# Altium project FitC_Project.PrjPcb (part 1 of 2)
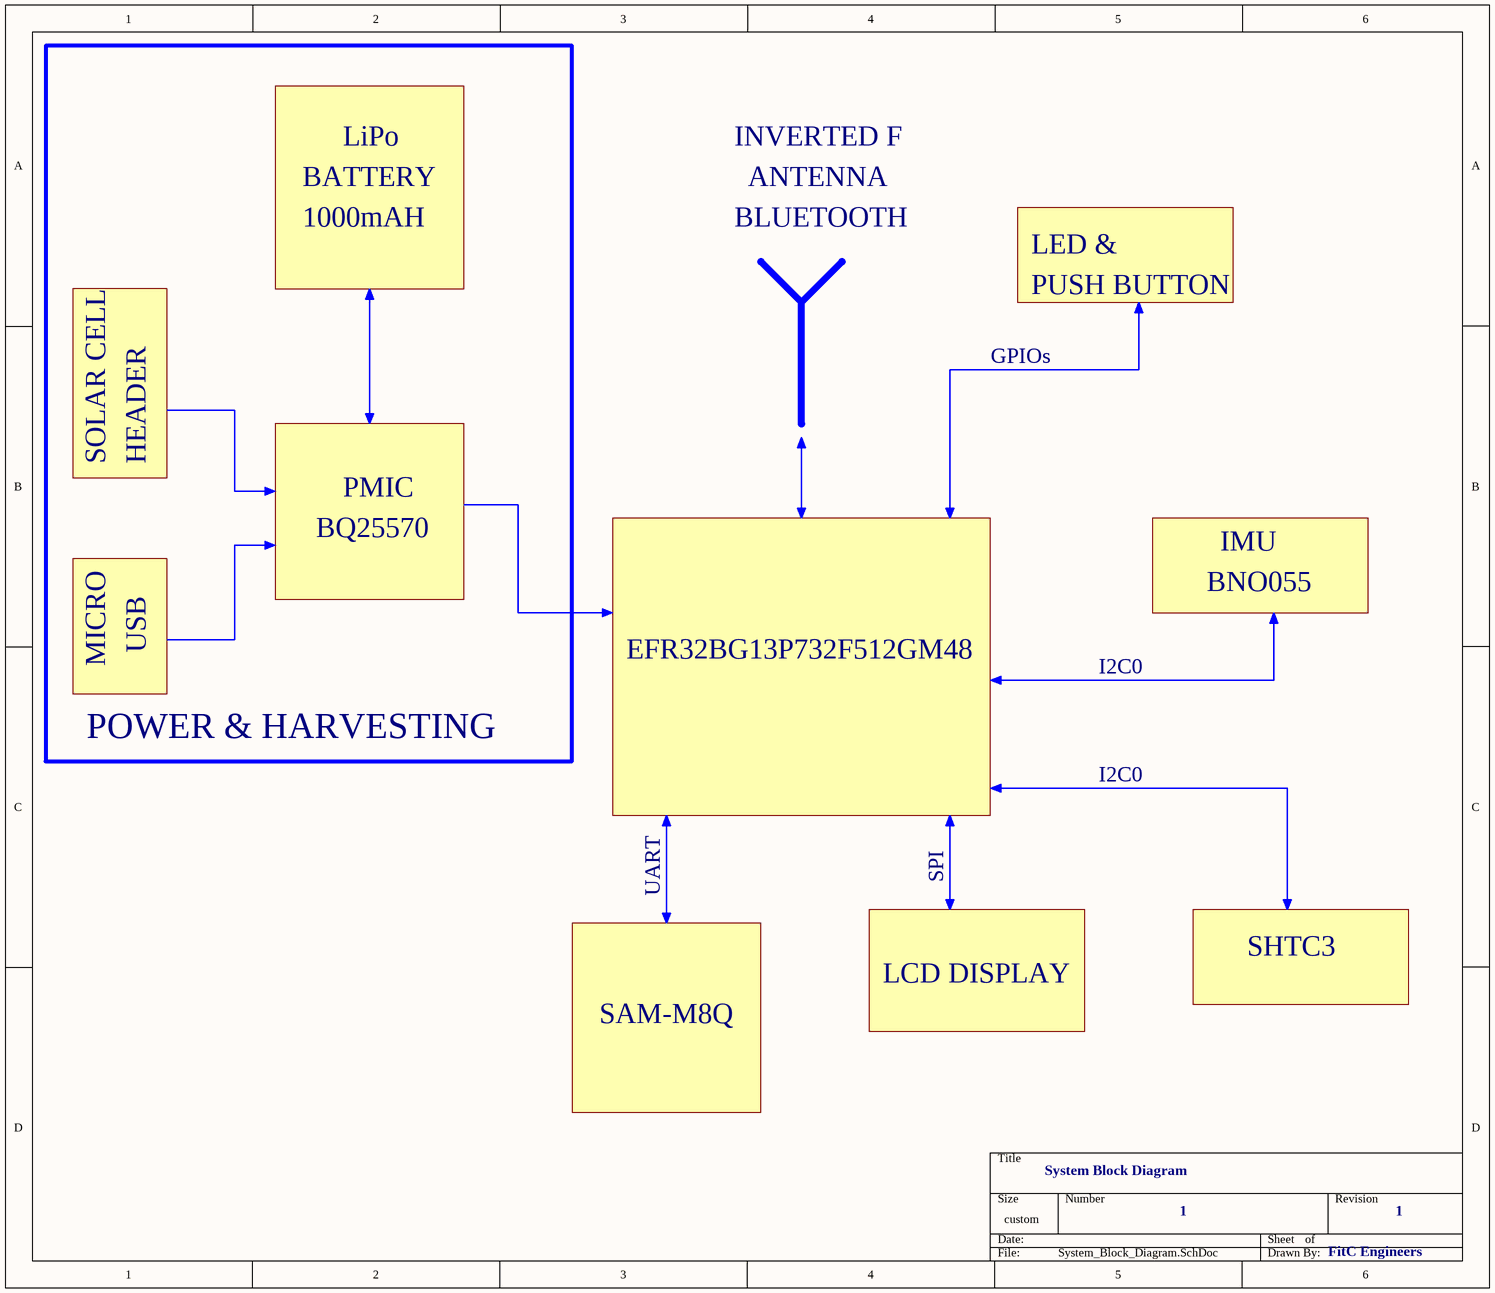
[diagram p0: System_Block_Diagram.SchDoc]
5 sheets, 117 parts. Net scope: global (net labels, ports and power ports of the same name join across sheets).
Board file: FitC_Layout.PcbDoc
Sheets:
  System_Block_Diagram.SchDoc
  Power_Management.SchDoc
  Microcontroller_Power_&_RF.SchDoc
  Sensors.SchDoc
  Microcontroller_IO.SchDoc

## Sheet System_Block_Diagram.SchDoc: System Block Diagram
size 279 x 241 mm; DrawnBy: FitC Engineers; DocumentNumber: 1; Revision: 1; SheetNumber: 1; SheetTotal: 5

### Notes on the sheet
- LiPo
- INVERTED F
- BATTERY
- 1000mAH
- BLUETOOTH
- ANTENNA
- LED &
- PUSH BUTTON
- GPIOs
- SOLAR CELL
- HEADER
- PMIC
- BQ25570
- IMU
- BNO055
- MICRO
- USB
- EFR32BG13P732F512GM48
- I2C0
- POWER & HARVESTING
- UART
- SPI
- SHTC3
- SAM-M8Q
- LCD DISPLAY

## Sheet Power_Management.SchDoc: Power Management
size B; DrawnBy: FitC Engineers; Revision: 1; SheetNumber: 2; SheetTotal: 5
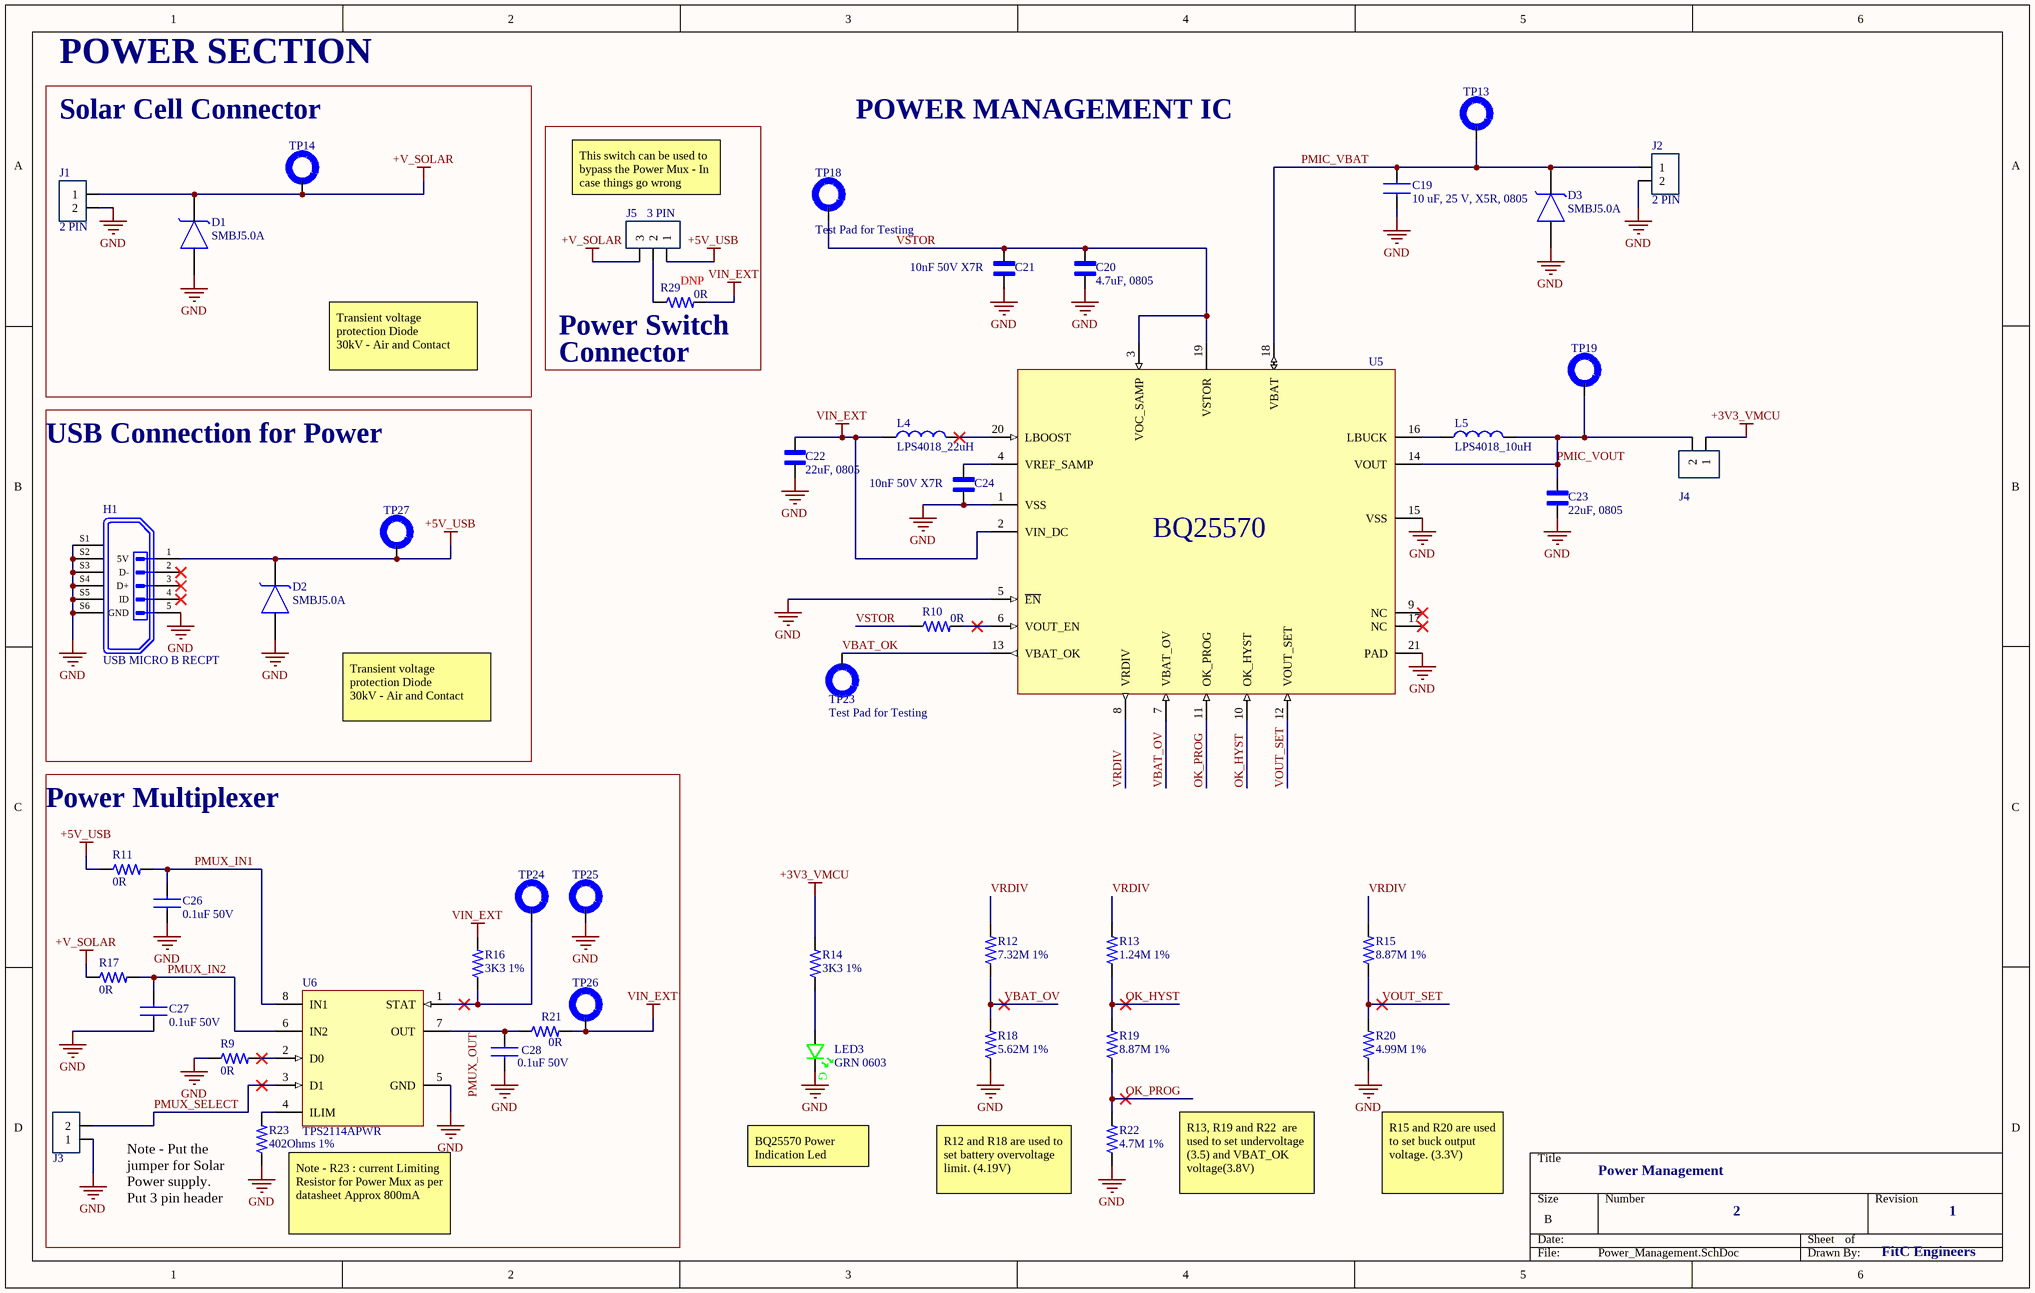
[diagram p1: Power_Management.SchDoc]

### Parts
C19  10 uF, 25 V, X5R, 0805  [CAP_0805_2012X14]
C20  4.7uF, 0805  [CAP_0805_2012X14]
C21  10nF 50V X7R  [CAP_0603_1MM]
C22  22uF, 0805  [CAP_0805_2012X14]
C23  22uF, 0805  [CAP_0805_2012X14]
C24  10nF 50V X7R  [CAP_0603_1MM]
C26  0.1uF 50V  [CAP_0603_1MM]
C27  0.1uF 50V  [CAP_0603_1MM]
C28  0.1uF 50V  [CAP_0603_1MM]
D1  SMBJ5.0A  [TVS_DIODE]
D2  SMBJ5.0A  [TVS_DIODE]
D3  SMBJ5.0A  [TVS_DIODE]
H1  USB MICRO B RECPT  [MICROUSB_AMPHENOL_10118194-0001LF]
J1  2 PIN  [2_PIN_100MIL]
J2  2 PIN  [2_PIN_100MIL]
J3  J_2_PIN_HEADER  [2_PIN_100MIL]  (value not drawn)
J4  J_2_PIN_HEADER  [2_PIN_100MIL]  (value not drawn)
J5  3 PIN  [3-PIN_MALE_HEADER_01-IN]
L4  LPS4018_22uH  [IND_LPS_3939X18N]
L5  LPS4018_10uH  [IND_LPS_3939X18N]
LED3  GRN 0603  [LED_0603_GRN_WL-SMCW]
R9  0R  [RES_0603_1608X06]
R10  0R  [RES_0603_1608X06]
R11  0R  [RES_0603_1608X06]
R12  7.32M 1%  [RES_0603_1608X06]
R13  1.24M 1%  [RES_0603_1608X06]
R14  3K3 1%  [RES_0603_1608X06]
R15  8.87M 1%  [RES_0603_1608X06]
R16  3K3 1%  [RES_0603_1608X06]
R17  0R  [RES_0603_1608X06]
R18  5.62M 1%  [RES_0603_1608X06]
R19  8.87M 1%  [RES_0603_1608X06]
R20  4.99M 1%  [RES_0603_1608X06]
R21  0R  [RES_0603_1608X06]
R22  4.7M 1%  [RES_0603_1608X06]
R23  402Ohms 1%  [RES_0603_1608X06]
R29  0R  [RES_0603_1608X06]
TP13  Test Pad for Testing  [1mm Test Pad]  (value not drawn)  (no BOM)
TP14  Test Pad for Testing  [1mm Test Pad]  (value not drawn)  (no BOM)
TP18  Test Pad for Testing  [1mm Test Pad]  (no BOM)
TP19  Test Pad for Testing  [1mm Test Pad]  (value not drawn)  (no BOM)
TP23  Test Pad for Testing  [1mm Test Pad]  (no BOM)
TP24  Test Pad for Testing  [1mm Test Pad]  (value not drawn)  (no BOM)
TP25  Test Pad for Testing  [1mm Test Pad]  (value not drawn)  (no BOM)
TP26  Test Pad for Testing  [1mm Test Pad]  (value not drawn)  (no BOM)
TP27  Test Pad for Testing  [1mm Test Pad]  (value not drawn)  (no BOM)
U5  BQ25570 - Nano Boost Charger and Buck Converter  [BQ25570_QFN]  (value not drawn)
U6  TPS2114APWR  [TPS2114APWR]

### Blocks framed on the sheet
POWER SECTION: D1 J1 TP14
USB Connection for Power: D2 H1 TP27
Power Multiplexer: C26-C28 J3 R9 R11 R16 R17 R21 R23 TP24-TP26 U6

### Nets
+3V3_VMCU: J4.1 R14.2
+5V_USB: D2.1(K) H1.1(5V) J5.1 R11.1 TP27.1
+V_SOLAR: D1.1(K) J1.1 J5.3 R17.1 TP14.1
GND: C19.1 C20.2 C21.2 C22.1 C23.2 C24.2 C26.2 C27.2 C28.2 D1.2(A) D2.2(A) D3.2(A) H1.5(GND) H1.S1 H1.S2 H1.S3 H1.S4 H1.S5 H1.S6 J1.2 J2.2 J3.1 LED3.C R9.1 R18.1 R20.1 R22.1 R23.1 TP25.1 U5.1(VSS) U5.5(~{EN}) U5.15(VSS) U5.21(PAD) U6.5(GND)
VIN_EXT: C22.2 L4.1 R16.2 R21.2 R29.2 TP26.1 U5.2(VIN_DC)
OK_HYST: R13.1 R19.2 U5.10(OK_HYST)
OK_PROG: R19.1 R22.2 U5.11(OK_PROG)
PMIC_VBAT: C19.2 D3.1(K) J2.1 TP13.1 U5.18(VBAT)
PMIC_VOUT: C23.1 J4.2 L5.2 TP19.1 U5.14(VOUT)
PMUX_IN1: C26.1 R11.2 U6.8(IN1)
PMUX_IN2: C27.1 R17.2 U6.6(IN2)
PMUX_OUT: C28.1 R21.1 U6.7(OUT)
PMUX_SELECT: J3.2 U6.3(D1)
VBAT_OK: TP23.1 U5.13(VBAT_OK)
VBAT_OV: R12.1 R18.2 U5.7(VBAT_OV)
VOUT_SET: R15.1 R20.2 U5.12(VOUT_SET)
VRDIV: R12.2 R13.2 R15.2 U5.8(VRDIV)
VSTOR: C20.1 C21.1 R10.1 TP18.1 U5.3(VOC_SAMP) U5.19(VSTOR)
NetC24_1: C24.1 U5.4(VREF_SAMP)
NetJ5_2: J5.2 R29.1
NetL4_2: L4.2 U5.20(LBOOST)
NetL5_1: L5.1 U5.16(LBUCK)
NetLED3_A: LED3.A R14.1
NetR9_2: R9.2 U6.2(D0)
NetR10_2: R10.2 U5.6(VOUT_EN)
NetR16_1: R16.1 TP24.1 U6.1(STAT)
NetR23_2: R23.2 U6.4(ILIM)

Not connected (* = marked no-connect by the designer): H1 2(D-)* 3(D+)* 4(ID)*; U5 9(NC)* 17(NC)*

### Notes on the sheet
- Solar Cell Connector
- POWER MANAGEMENT IC
- This switch can be used to bypass the Power Mux - In case things go wrong
- (near R29) DNP
- Transient voltage protection Diode
  30kV - Air and Contact
- (near R29) Power Switch
- (near R29) Connector
- BQ25570 Power Indication Led
- (near R23) Note - Put the jumper for Solar Power supply.
  Put 3 pin header
- Note - R23 : current Limiting Resistor for Power Mux as per datasheet Approx 800mA
- (near R22) R12 and R18 are used to set battery overvoltage limit. (4.19V)
- R13, R19 and R22  are used to set undervoltage (3.5) and VBAT_OK voltage(3.8V)
- R15 and R20 are used to set buck output voltage. (3.3V)
- (in symbol 150060GS75000) G
- (in symbol BQ25570RGRR) BQ25570

### Library data of the parts
C19 = GRM21BR61E106KA73K: 0805 25 V 10 uF ±20% Tolerance X5R Monolithic Ceramic Chip Capacitor; Manufacturer: Murata; Capacitance: 10uF; Voltage Rating: 25V; Tolerance: 10%; Supplier 1: Digi-Key; Manufacturer Part Number: GRM21BR61E106KA73K; RoHS: Yes; Category: Ceramic Capacitors; Stock 1: 451324; Pricing 1: 1=0.21000, 10=0.14400, 50=0.08640, 100=0.07290, 500=0.04990, 1000=0.04414, 2500=0.04222, 5000=0.03838 (USD); Mount: Surface Mount; Case/Package: 0805; Weight: 0.000335oz; Min Operating Temperature: -55°C; Max Operating Temperature: 85°C; Packaging: Tape and Reel; Package Quantity: 10000; Dielectric: X5R; Voltage Rating (DC): 25V; Length: 0.079inch; Width: 0.049inch; Thickness: 0.055inch; RoHS Compliant: Yes; ComponentLink1URL: http://www.mouser.com/ds/2/281/c02e-2905.pdf?src-supplier=Mouser; ComponentLink1Description: http://www.mouser.com/ds/2/281/c02e-2905.pdf?src-supplier=Mouser; ComponentLink2URL: http://search.murata.co.jp/Ceramy/image/img/A01X/G101/ENG/GRM21BR61E106KA73-01.pdf?src-supplier=Digi-Key; ComponentLink2Description: http://search.murata.co.jp/Ceramy/image/img/A01X/G101/ENG/GRM21BR61E106KA73-01.pdf?src-supplier=Digi-Key; ComponentLink3URL: https://search.murata.co.jp/Ceramy/image/img/A01X/G101/ENG/GRM21BR61E106KA73-01.pdf?src-supplier=Digi-Key; ComponentLink3Description: https://search.murata.co.jp/Ceramy/image/img/A01X/G101/ENG/GRM21BR61E106KA73-01.pdf?src-supplier=Digi-Key
C20 = CC0805KKX5R8BB475: 0805 4.7 uF 25 V ±10% Tolerance X5R SMT Multilayer Ceramic Capacitor; Manufacturer: Yageo; Voltage Rating (DC): 25V; Supplier 1: Digi-Key; Manufacturer Part Number: CC0805KKX5R8BB475; RoHS: Yes; Category: Ceramic Capacitors; Stock 1: 260911; Pricing 1: 1=0.39000, 10=0.27000, 50=0.18940, 100=0.16230, 500=0.12172, 1000=0.10278 (USD); Mount: Surface Mount; Case/Package: 0805; Case Code (Imperial): 0805; Case Code (Metric): 2012; Weight: 0.000194oz; Min Operating Temperature: -55°C; Max Operating Temperature: 85°C; Tolerance: 10%; Packaging: Tape and Reel; Capacitance: 4.7uF; Voltage Rating: 25V; Dielectric: X5R; Termination: SMD/SMT; Resistor Type: Ceramic; Series: CC; Construction: Flat; Length: 2mm; Width: 0.049inch; Height: 1.25mm; Thickness: 0.057inch; Depth: 1.25mm; Radiation Hardening: No; Lead Free: Lead Free; Halogen Free: Halogen Free; RoHS Compliant: Yes; ComponentLink1URL: https://datasheet.ciiva.com/26946/getdatasheetpartid-788588-26946123.pdf?src-supplier=Verical; ComponentLink1Description: https://datasheet.ciiva.com/26946/getdatasheetpartid-788588-26946123.pdf?src-supplier=Verical; Supplier Part Number 1: 311-1871-1-ND
C21 C24 = CL10B103KB8WPJC: Capacitor Ceramic 0.01uF 10% 50V 2-Pin Surface Mount T/R; Manufacturer: Samsung; Supplier 1: Digi-Key; Manufacturer Part Number: CL10B103KB8WPJC; RoHS: Yes; Category: Ceramic Capacitors; Stock 1: 23609; Pricing 1: 1=0.11000, 10=0.08100, 50=0.04620, 100=0.03830, 500=0.02684, 1000=0.02222 (USD); RoHS Compliant: Yes; Supplier Part Number 1: 1276-CL10B103KB8WPJCCT-ND
C22 C23 = CC0805MKX5R8BB226: Multilayer Ceramic Capacitors 0805 25V X5R 226 20% 7'REEL PLASTIC; Manufacturer: Yageo; Supplier 1: Digi-Key; Manufacturer Part Number: CC0805MKX5R8BB226; RoHS: Yes; Category: Ceramic Capacitors; Stock 1: 1126063; Pricing 1: 1=0.41000, 10=0.29200, 50=0.22080, 100=0.19230, 500=0.14248, 1000=0.12110 (USD); Mount: Surface Mount; Case/Package: 0805; Case Code (Metric): 2012; Case Code (Imperial): 0805; Weight: 0.000194oz; Min Operating Temperature: -55°C; Max Operating Temperature: 85°C; Packaging: Tape and Reel; Capacitance: 22uF; Voltage Rating: 25V; Tolerance: 20%; Dielectric: X5R; Termination: SMD/SMT; Voltage Rating (DC): 25V; Package Quantity: 3000; Length: 0.079inch; Width: 0.049inch; Height: 1.25mm; Thickness: 0.057inch; Lead Free: Lead Free; Halogen Free: Halogen Free; RoHS Compliant: Yes; ComponentLink1URL: http://www.mouser.com/ds/2/447/Yageo_UPY-GP_NP0_16V-to-50V_9-358835.pdf?src-supplier=Mouser; ComponentLink1Description: http://www.mouser.com/ds/2/447/Yageo_UPY-GP_NP0_16V-to-50V_9-358835.pdf?src-supplier=Mouser; ComponentLink2URL: http://www.yageo.com/documents/recent/UPY-GPHC_X5R_4V-to-50V_25.pdf?src-supplier=Digi-Key; ComponentLink2Description: http://www.yageo.com/documents/recent/UPY-GPHC_X5R_4V-to-50V_25.pdf?src-supplier=Digi-Key; Supplier Part Number 1: 311-1903-1-ND
C26-C28 = C0603X104K5RAC3121: Cap Ceramic 0.1uF 50V X7R 10% Pad SMD 0603 Flexible Termination 125C Automotive Medical Bag; Manufacturer: KEMET; Supplier 1: Digi-Key; Manufacturer Part Number: C0603X104K5RAC3121; RoHS: No; Category: Ceramic Capacitors; Stock 1: 4337; Pricing 1: 1=0.21000, 10=0.14400, 50=0.08660, 100=0.07320, 500=0.05004, 1000=0.04428 (USD); ComponentLink1URL: https://www.verical.com/server-webapp/html/getDatasheet?partID=788232&src-supplier=Verical; ComponentLink1Description: https://www.verical.com/server-webapp/html/getDatasheet?partID=788232&src-supplier=Verical; Supplier Part Number 1: 399-C0603X104K5RAC3121CT-ND
D1-D3 = SMBJ5.0A: Diode TVS Single Uni-Dir 5V 600W 2-Pin SMBJ; Manufacturer: Bourns; Direction: Unidirectional; Operating Supply Voltage: 3.5V; Max Surge Current: 100A; Reverse Breakdown Voltage: 6.4V; Number of Elements: 1; Clamping Voltage: 9.2V; Power Line Protection: No; Breakdown Voltage: 7.25V; Max Reverse Leakage Current: 800uA; Test Current: 10mA; Peak Pulse Current: 65.2A; ESD Protection: Yes; Diode Type: ZENER; Supplier 1: Digi-Key; Manufacturer Part Number: SMBJ5.0A; RoHS: Yes; Category: TVS Diodes; Stock 1: 1479; Pricing 1: 1=0.51000, 10=0.38500, 100=0.23990, 500=0.16414, 1000=0.12626 (USD); Mount: Surface Mount; Case/Package: DO-214AA; Number of Pins: 2; Min Operating Temperature: -55°C; Max Operating Temperature: 150°C; Package Quantity: 1; Packaging: Tape and Reel; Series: SMBJ; Number of Unidirectional Channels: 1; Reverse Standoff Voltage: 5V; Min Breakdown Voltage: 6.4V; Peak Pulse Power: 600W; Number of Channels: 1; Polarity: Unidirectional; Termination: SMD/SMT; Max Power Dissipation: 600W; Max Breakdown Voltage: 7.25V; Element Configuration: Single; Leakage Current: 800uA; Resistor Type: Zener; Length: 4.57mm; Width: 3.94mm; Height: 2.42mm; Radiation Hardening: No; REACH SVHC: No SVHC; RoHS Compliant: Yes; ComponentLink1URL: https://datasheet.ciiva.com/5749/1677318-5749456.pdf?src-supplier=Farnell; ComponentLink1Description: https://datasheet.ciiva.com/5749/1677318-5749456.pdf?src-supplier=Farnell; ComponentLink2URL: https://datasheet.ciiva.com/25624/0900766b81122151-25624859.pdf?src-supplier=RSComponents; ComponentLink2Description: https://datasheet.ciiva.com/25624/0900766b81122151-25624859.pdf?src-supplier=RSComponents; ComponentLink3URL: https://datasheet.ciiva.com/334/smbj-334064.pdf?src-supplier=Digi-Key; ComponentLink3Description: https://datasheet.ciiva.com/334/smbj-334064.pdf?src-supplier=Digi-Key; ComponentLink4URL: https://datasheet.ciiva.com/334/smbj-334065.pdf?src-supplier=Digi-Key; ComponentLink4Description: https://datasheet.ciiva.com/334/smbj-334065.pdf?src-supplier=Digi-Key; ComponentLink5URL: https://datasheet.ciiva.com/334/smbj-334066.pdf?src-supplier=Digi-Key; ComponentLink5Description: https://datasheet.ciiva.com/334/smbj-334066.pdf?src-supplier=Digi-Key; ComponentLink6URL: https://datasheet.ciiva.com/4510/smbj-51809-4510005.pdf?src-supplier=Mouser; ComponentLink6Description: https://datasheet.ciiva.com/4510/smbj-51809-4510005.pdf?src-supplier=Mouser; ComponentLink7URL: https://datasheet.ciiva.com/3021/smbj-3021451.pdf?src-supplier=Avnet; ComponentLink7Description: https://datasheet.ciiva.com/3021/smbj-3021451.pdf?src-supplier=Avnet; ComponentLink8URL: https://datasheet.ciiva.com/3021/smbj-3021452.pdf?src-supplier=Avnet; ComponentLink8Description: https://datasheet.ciiva.com/3021/smbj-3021452.pdf?src-supplier=Avnet; ComponentLink9URL: https://datasheet.ciiva.com/30094/smbj-30094061.pdf?src-supplier=Onlinecomponents.com; ComponentLink9Description: https://datasheet.ciiva.com/30094/smbj-30094061.pdf?src-supplier=Onlinecomponents.com; ComponentLink10URL: https://datasheet.ciiva.com/8031/1677318-8031160.pdf?src-supplier=Element14; ComponentLink10Description: https://datasheet.ciiva.com/8031/1677318-8031160.pdf?src-supplier=Element14; ComponentLink11URL: https://datasheet.ciiva.com/48712/001056320-da-01-en-tvs-diode-smbj5-0a-do-214aa-bou-48712572.pdf?src-supplier=Conrad; ComponentLink11Description: https://datasheet.ciiva.com/48712/001056320-da-01-en-tvs-diode-smbj5-0a-do-214aa-bou-48712572.pdf?src-supplier=Conrad; Supplier Part Number 1: SMBJ5.0ABCT-ND
H1 = 10118194-0001LF: USB - micro B USB 2.0 Receptacle Connector 5 Position Surface Mount, Right Angle; Through Hole; Manufacturer: Amphenol FCI; Number of Terminals/Pins: 5; Current Rating: 1.8A; Connector Type: USB,Receptacle; Insulation Resistance: 1GR; Number of Ports: 1; Max Voltage Rating (AC): 100V; Pitch: 0.65mm; Supplier 1: Digi-Key; Manufacturer Part Number: 10118194-0001LF; RoHS: Yes; Category: USB Connectors; Stock 1: 87961; Pricing 1: 1=0.48000, 10=0.45100, 25=0.38680, 50=0.32860, 100=0.31580, 250=0.28360, 500=0.27070 (USD); Mount: Surface Mount,Horizontal; Contact Material: Copper Alloy; Contact Plating: Gold; Housing Material: Polymer; Color: Black; Min Operating Temperature: -55°C; Max Operating Temperature: 85°C; Package Quantity: 9600; Packaging: Tape and Reel; Gender: Receptacle; Number of Contacts: 5; Termination: Solder; Orientation: Right Angle; Features: Shielded; Length: 8.05mm; Depth: 5mm; Radiation Hardening: No; Lead Free: Lead Free; Flammability Rating: UL94 V-0; ComponentLink1URL: https://datasheet.ciiva.com/4598/10118194ac-197217-4598807.pdf?src-supplier=Mouser; ComponentLink1Description: https://datasheet.ciiva.com/4598/10118194ac-197217-4598807.pdf?src-supplier=Mouser; ComponentLink2URL: https://datasheet.ciiva.com/26945/getdatasheetpartid-418619-26945695.pdf?src-supplier=Verical; ComponentLink2Description: https://datasheet.ciiva.com/26945/getdatasheetpartid-418619-26945695.pdf?src-supplier=Verical; ComponentLink3URL: https://datasheet.ciiva.com/851/10118194-851110.pdf?src-supplier=Digi-Key; ComponentLink3Description: https://datasheet.ciiva.com/851/10118194-851110.pdf?src-supplier=Digi-Key; ComponentLink4URL: https://datasheet.ciiva.com/851/10118194-851111.pdf?src-supplier=Digi-Key; ComponentLink4Description: https://datasheet.ciiva.com/851/10118194-851111.pdf?src-supplier=Digi-Key; Supplier Part Number 1: 609-4618-6-ND
J1 J2 = J_2_PIN_HEADER: 2.54mm Straight 2 1 Header，Breakaway Through Hole,P=2.54mm Pin Header & Female Header ROHS; MFR Part #: MTP125-1102S1; Type: Extended; Datasheetxx: https://datasheet.lcsc.com/lcsc/1912111437_MINTRON-MTP125-1102S1_C358684.pdf; LCSC Part#: C358684; Value: 2 PIN
J3 J4 = J_2_PIN_HEADER: 2 Position Header Connector 0.100" (2.54mm) Through Hole Tin
J5 = J_3_PIN_HEADER: 3 2.54mm Straight 1 Header，Breakaway Through Hole Pin Header & Female Header ROHS; MFR Part #: C49257; Type: Extended; Datasheet: https://datasheet.lcsc.com/lcsc/1811132313_BOOMELE-Boom-Precision-Elec-C49257_C49257.pdf; LCSC Part#: C49257; Value: 3 PIN
L4 = LPS4018-223MRC: Power inductor, shielded, 20/30% tol, SMT, RoHS, lead-free, halogen-free; Manufacturer: Coilcraft; Core Material: Ferrite; Inductance: 22uH; Tolerance: 20%; Max DC Current: 830mA; DC Resistance (DCR): 360mR; Self Resonant Frequency: 26MHz; Test Frequency: 100kHz; Supplier 1: Mouser; Manufacturer Part Number: LPS4018-223MRC; Category: Fixed Inductors; Stock 1: 29709; Pricing 1: 1=1.16000, 10=1.09000, 50=1.09000, 100=1.09000, 1000=0.58900, 10000=0.54200 (USD); Case/Package: SMD/SMT; Weight: 0.003527oz; Min Operating Temperature: -40°C; Max Operating Temperature: 85°C; Shielding: Shielded; Termination: SMD/SMT; Packaging: Tape and Reel; Package Quantity: 1000; Length: 4mm; Width: 4mm; Height: 1.7mm; ComponentLink1URL: http://www.mouser.com/ds/2/597/lps4018-270702.pdf?src-supplier=Mouser; ComponentLink1Description: http://www.mouser.com/ds/2/597/lps4018-270702.pdf?src-supplier=Mouser; ComponentLink2URL: https://datasheet.octopart.com/LPS4018-223MRC-Coilcraft-datasheet-10791166.pdf?src-supplier=Coilcraft+Direct; ComponentLink2Description: https://datasheet.octopart.com/LPS4018-223MRC-Coilcraft-datasheet-10791166.pdf?src-supplier=Coilcraft+Direct; ComponentLink3URL: https://datasheet.octopart.com/LPS4018-223MRC-Coilcraft-datasheet-138895956.pdf?src-supplier=Upverter; ComponentLink3Description: https://datasheet.octopart.com/LPS4018-223MRC-Coilcraft-datasheet-138895956.pdf?src-supplier=Upverter; Supplier Part Number 1: 994-LPS4018-223MRC
L5 = LPS4018-103MRC: Power inductor, shielded, 20/30% tol, SMT, RoHS, lead-free, halogen-free; Manufacturer: Coilcraft; Core Material: Ferrite; Inductance: 10uH; Tolerance: 20%; Max DC Current: 1.3A; DC Resistance (DCR): 200mR; Self Resonant Frequency: 40MHz; Test Frequency: 100kHz; Supplier 1: Mouser; Manufacturer Part Number: LPS4018-103MRC; Category: Inductors; Stock 1: 96504; Pricing 1: 1=1.16000, 10=1.09000, 50=1.09000, 100=1.09000, 250=0.95300, 500=0.65500, 1000=0.58900, 2000=0.54200, 10000=0.54200 (USD); Case/Package: SMD/SMT; Weight: 0.003527oz; Min Operating Temperature: -40°C; Max Operating Temperature: 85°C; Shielding: Shielded; Termination: SMD/SMT; Packaging: Tape and Reel; Package Quantity: 1000; Length: 4mm; Width: 4mm; Height: 1.7mm; RoHS Compliant: No; ComponentLink1URL: http://www.mouser.com/ds/2/597/lps4018-270702.pdf?src-supplier=Mouser; ComponentLink1Description: http://www.mouser.com/ds/2/597/lps4018-270702.pdf?src-supplier=Mouser; ComponentLink2URL: https://datasheet.octopart.com/LPS4018-103MRC-Coilcraft-datasheet-10791166.pdf?src-supplier=Coilcraft+Direct; ComponentLink2Description: https://datasheet.octopart.com/LPS4018-103MRC-Coilcraft-datasheet-10791166.pdf?src-supplier=Coilcraft+Direct; Supplier Part Number 1: 994-LPS4018-103MRC
LED3 = 150060GS75000: LED, 0603, GREEN, 430MCD, 520NM; Manufacturer: Wurth Electronics; Dynamic Catalog: 0603 Rectangle with Flat Top Chip LEDs; 3D Model: SMCW_0603.igs / SMCW_0603.stp / SMCW_0603.wrl; Wavelength - Peak: 515nm; Voltage - Forward (Vf) (Typ): 3.2V; Current - Test: 20mA; Viewing Angle: 140°; Lens Type: Clear; Lens Style/Size: Rectangle with Flat Top, 1.1mm x 0.7mm; Other Names: 732-4971-2; Supplier 1: Digi-Key; Manufacturer Part Number: 150060GS75000; Stock 1: 34964; Pricing 1: 1=0.14, 50=0.129, 100=0.11, 500=0.095 (USD); Standard Package: 4,000; Category: Optoelectronics; Family: LED Indication - Discrete; Series: WL-SMCW; Packaging: Tape & Reel (TR); Color: Green; Wavelength - Dominant: 520nm; Millicandela Rating: 430mcd; Package / Case: 0603 (1608 Metric); Size / Dimension: 1.60mm L x 0.80mm W; Height: 0.70mm; Mounting Type: Surface Mount; Online Catalog: 0603 Rectangle with Flat Top Chip LEDs; ComponentLink1URL: https://katalog.we-online.de/led/datasheet/150060GS75000.pdf?src-supplier=Digi-Key; ComponentLink1Description: https://katalog.we-online.de/led/datasheet/150060GS75000.pdf?src-supplier=Digi-Key; ComponentLink2URL: http://www.produktinfo.conrad.com/datenblaetter/750000-774999/759427-da-01-en-CHIPLED_0603_W_KL_GRUEN_150060GS75000.pdf?src-supplier=Conrad; ComponentLink2Description: http://www.produktinfo.conrad.com/datenblaetter/750000-774999/759427-da-01-en-CHIPLED_0603_W_KL_GRUEN_150060GS75000.pdf?src-supplier=Conrad; Supplier Part Number 1: 732-4971-1-ND
R9-R11 R17 R21 R29 = RMCF0603ZT0R00: Res Thkflm 0603 0 Ohm Jumper 1/10W 100Ppm/ C Smd Rohs Compliant: Yes; Manufacturer: Stackpole Electronics; Power Rating: 100mW; Current Rating: 1A; Working Voltage: 75V; Supplier 1: Digi-Key; Manufacturer Part Number: RMCF0603ZT0R00; RoHS: Yes; Category: Chip SMD Resistors; Pricing 1: 1=0.10000, 10=0.01300, 25=0.00960, 50=0.00720, 100=0.00530, 250=0.00404, 500=0.00324, 1000=0.00238 (USD); Mount: Surface Mount; Case/Package: 0603; Case Code (Metric): 1608; Case Code (Imperial): 0603; Contact Plating: Tin,Matte; Min Operating Temperature: -55°C; Max Operating Temperature: 155°C; Resistance: 0R; Packaging: Tape and Reel; Resistor Type: Thick Film; Number of Terminations: 2; Max Power Dissipation: 100mW; Features: Automotive AEC-Q200; Series: RMCF; Construction: Rectangular; Length: 1.55mm; Width: 0.031inch; Height: 0.022inch; Depth: 0.8mm; Radiation Hardening: No; Lead Free: Lead Free; Military Standard: Not; RoHS Compliant: Yes; ComponentLink1URL: https://www.seielect.com/catalog/SEI-Packaging.pdf?src-supplier=Digi-Key; ComponentLink1Description: https://www.seielect.com/catalog/SEI-Packaging.pdf?src-supplier=Digi-Key; ComponentLink2URL: https://www.seielect.com/Catalog/SEI-RMCF_RMCP.pdf?src-supplier=Digi-Key; ComponentLink2Description: https://www.seielect.com/Catalog/SEI-RMCF_RMCP.pdf?src-supplier=Digi-Key; ComponentLink3URL: https://www.seielect.com/catalog/SEI-Packaging.pdf?src-supplier=Arrow+Electronics; ComponentLink3Description: https://www.seielect.com/catalog/SEI-Packaging.pdf?src-supplier=Arrow+Electronics; ComponentLink4URL: https://www.seielect.com/catalog/SEI-Packaging.pdf?src-supplier=Avnet; ComponentLink4Description: https://www.seielect.com/catalog/SEI-Packaging.pdf?src-supplier=Avnet; ComponentLink5URL: https://www.seielect.com/catalog/SEI-Packaging.pdf?src-supplier=Verical; ComponentLink5Description: https://www.seielect.com/catalog/SEI-Packaging.pdf?src-supplier=Verical; Supplier Part Number 1: RMCF0603ZT0R00CT-ND
R12 = RMCF0603FT7M32: Res Thick Film 0603 7.32M Ohm 1% 1/10W ±200ppm/°C Molded SMD SMD Paper T/R; Manufacturer: Stackpole Electronics; Resistance: 7.32MR; Supplier 1: Digi-Key; Manufacturer Part Number: RMCF0603FT7M32; RoHS: Yes; Category: Chip SMD Resistors; Stock 1: 10385; Pricing 1: 1=0.10000, 10=0.02500, 100=0.01020, 1000=0.00457, 2500=0.00397 (USD); Mount: Surface Mount; Case/Package: 0603; Contact Plating: Tin,Matte; Min Operating Temperature: -55°C; Max Operating Temperature: 155°C; Packaging: Tape and Reel; Tolerance: 1%; Resistor Type: Thick Film; Temperature Coefficient: 200ppm/°C; Radiation Hardening: No; RoHS Compliant: Yes; ComponentLink1URL: https://www.seielect.com/catalog/SEI-RMCF_RMCP.pdf?src-supplier=Avnet; ComponentLink1Description: https://www.seielect.com/catalog/SEI-RMCF_RMCP.pdf?src-supplier=Avnet; ComponentLink2URL: https://www.seielect.com/catalog/sei-rmcf_rmcp.pdf?src-supplier=Digi-Key; ComponentLink2Description: https://www.seielect.com/catalog/sei-rmcf_rmcp.pdf?src-supplier=Digi-Key; Supplier Part Number 1: RMCF0603FT7M32CT-ND
R13 = CRCW06031M24FKEA: Res Thick Film 0603 1.24M Ohm 1% 1/10W ±100ppm/°C Molded SMD SMD Paper T/R; Manufacturer: Vishay; Power Rating: 100mW; Voltage Rating: 75V; Resistance: 1.24MR; Supplier 1: Digi-Key; Manufacturer Part Number: CRCW06031M24FKEA; RoHS: Yes; Category: Chip SMD Resistors; Stock 1: 4930; Pricing 1: 1=0.10000, 10=0.03800, 100=0.01560, 1000=0.00701, 2500=0.00608 (USD); Case/Package: 0603; Weight: 7.1E-05oz; Case Code (Imperial): 0603; Case Code (Metric): 1608; Contact Plating: Tin; Min Operating Temperature: -55°C; Max Operating Temperature: 155°C; Tolerance: 1%; Packaging: Tape and Reel; Package Quantity: 10; Resistor Type: Thick Film; Termination: SMD/SMT; Number of Terminations: 2; Max Power Dissipation: 100mW; Temperature Coefficient: 100ppm/°C; Voltage Rating (DC): 75V; Features: Automotive AEC-Q200; Series: CRCW; Resistance Tolerance: 1%; Construction: Rectangular; Length: 1.55mm; Width: 0.85mm; Height: 0.02inch; Depth: 0.85mm; Radiation Hardening: No; REACH SVHC: Unknown; Military Standard: Not; Lead Free: Lead Free; RoHS Compliant: Yes; ComponentLink1URL: https://datasheet.ciiva.com/2466/dcrcwe3-2466668.pdf?src-supplier=Digi-Key; ComponentLink1Description: https://datasheet.ciiva.com/2466/dcrcwe3-2466668.pdf?src-supplier=Digi-Key; ComponentLink2URL: https://datasheet.ciiva.com/2466/dcrcwe3-2466669.pdf?src-supplier=Digi-Key; ComponentLink2Description: https://datasheet.ciiva.com/2466/dcrcwe3-2466669.pdf?src-supplier=Digi-Key; ComponentLink3URL: https://datasheet.ciiva.com/2466/dcrcwe3-2466670.pdf?src-supplier=Digi-Key; ComponentLink3Description: https://datasheet.ciiva.com/2466/dcrcwe3-2466670.pdf?src-supplier=Digi-Key; ComponentLink4URL: https://datasheet.ciiva.com/7168/1635184-7168479.pdf?src-supplier=Newark; ComponentLink4Description: https://datasheet.ciiva.com/7168/1635184-7168479.pdf?src-supplier=Newark; ComponentLink5URL: https://datasheet.ciiva.com/7792/dcrcwe3-7792107.pdf?src-supplier=Element14; ComponentLink5Description: https://datasheet.ciiva.com/7792/dcrcwe3-7792107.pdf?src-supplier=Element14; ComponentLink6URL: https://datasheet.ciiva.com/22676/1700796-22676807.pdf?src-supplier=Element14; ComponentLink6Description: https://datasheet.ciiva.com/22676/1700796-22676807.pdf?src-supplier=Element14; ComponentLink7URL: https://datasheet.ciiva.com/22709/1697337-22709054.pdf?src-supplier=Element14; ComponentLink7Description: https://datasheet.ciiva.com/22709/1697337-22709054.pdf?src-supplier=Element14; ComponentLink8URL: https://datasheet.ciiva.com/7670/1697337-7670533.pdf?src-supplier=Element14; ComponentLink8Description: https://datasheet.ciiva.com/7670/1697337-7670533.pdf?src-supplier=Element14; Supplier Part Number 1: 541-1.24MHCT-ND
R14 R16 = RMCF0603FT3K30: Res Thick Film 0603 3.3K Ohm 1% 0.1W(1/10W) ±100ppm/C Pad SMD Automotive T/R; Manufacturer: Stackpole Electronics; Resistance: 3.3kR; Max Power Dissipation: 100mW; Temperature Coefficient: 100ppm/°C; Supplier 1: Digi-Key; Manufacturer Part Number: RMCF0603FT3K30; RoHS: Yes; Category: Chip SMD Resistors; Stock 1: 471315; Pricing 1: 1=0.10000, 10=0.01700, 100=0.00680, 1000=0.00305, 2500=0.00264 (USD); Mount: Surface Mount; Case/Package: 0603; Case Code (Metric): 1608; Case Code (Imperial): 0603; Contact Plating: Tin,Matte; Min Operating Temperature: -55°C; Max Operating Temperature: 155°C; Packaging: Tape and Reel; Tolerance: 1%; Resistor Type: Thick Film; Number of Terminations: 2; Features: Automotive AEC-Q200; Series: RMCF; Construction: Rectangular; Length: 0.061inch; Width: 0.031inch; Height: 0.022inch; Depth: 0.8mm; Radiation Hardening: No; Military Standard: Not; RoHS Compliant: Yes; ComponentLink1URL: https://datasheet.ciiva.com/15193/getdatasheetpartid-376121-15193477.pdf?src-supplier=Verical; ComponentLink1Description: https://datasheet.ciiva.com/15193/getdatasheetpartid-376121-15193477.pdf?src-supplier=Verical; Supplier Part Number 1: RMCF0603FT3K30CT-ND
R15 R19 = CRCW06038M87FKEA: Res Thick Film 0603 8.87M Ohm 1% 1/10W ±100ppm/°C Molded SMD SMD Paper T/R; Manufacturer: Vishay; Resistance: 8.87MR; Power Rating: 100mW; Voltage Rating: 75V; Supplier 1: Digi-Key; Manufacturer Part Number: CRCW06038M87FKEA; RoHS: Yes; Category: Chip SMD Resistors; Stock 1: 33773; Pricing 1: 1=0.10000, 10=0.03800, 100=0.01560, 1000=0.00701, 2500=0.00608 (USD); Case/Package: 0603; Number of Pins: 2; Weight: 7.1E-05oz; Case Code (Imperial): 0603; Case Code (Metric): 1608; Contact Plating: Tin; Min Operating Temperature: -55°C; Max Operating Temperature: 155°C; Tolerance: 1%; Packaging: Tape and Reel; Termination: SMD/SMT; Temperature Coefficient: 100ppm/°C; Resistor Type: Thick Film; Voltage Rating (DC): 75V; Features: Automotive AEC-Q200; Series: CRCW; Max Power Dissipation: 100mW; Number of Terminations: 2; Resistance Tolerance: 1%; Construction: Rectangular; Length: 1.55mm; Width: 0.85mm; Height: 0.45mm; Depth: 0.85mm; Radiation Hardening: No; REACH SVHC: Unknown; Military Standard: Not; Lead Free: Lead Free; RoHS Compliant: Yes; ComponentLink1URL: https://datasheet.ciiva.com/5571/dcrcwe3-109170-5571653.pdf?src-supplier=Mouser; ComponentLink1Description: https://datasheet.ciiva.com/5571/dcrcwe3-109170-5571653.pdf?src-supplier=Mouser; ComponentLink2URL: https://datasheet.ciiva.com/9054/dcrcwe3-9054872.pdf?src-supplier=Avnet; ComponentLink2Description: https://datasheet.ciiva.com/9054/dcrcwe3-9054872.pdf?src-supplier=Avnet; ComponentLink3URL: https://datasheet.ciiva.com/22676/1700796-22676842.pdf?src-supplier=Element14; ComponentLink3Description: https://datasheet.ciiva.com/22676/1700796-22676842.pdf?src-supplier=Element14; ComponentLink4URL: https://datasheet.ciiva.com/22676/1700796-22676843.pdf?src-supplier=Element14; ComponentLink4Description: https://datasheet.ciiva.com/22676/1700796-22676843.pdf?src-supplier=Element14; Supplier Part Number 1: 541-8.87MHCT-ND
R18 = CRCW06035M62FKEA: Res Thick Film 0603 5.62M Ohm 1% 1/10W ±100ppm/°C Molded SMD SMD Paper T/R; Manufacturer: Vishay; Power Rating: 100mW; Voltage Rating: 75V; Resistance: 5.62MR; Supplier 1: Digi-Key; Manufacturer Part Number: CRCW06035M62FKEA; RoHS: Yes; Category: Chip SMD Resistors; Stock 1: 4138; Pricing 1: 1=0.10000, 10=0.03800, 100=0.01560, 1000=0.00701, 2500=0.00608 (USD); Case/Package: 0603; Number of Pins: 2; Weight: 7.1E-05oz; Case Code (Metric): 1608; Case Code (Imperial): 0603; Contact Plating: Tin; Min Operating Temperature: -55°C; Max Operating Temperature: 155°C; Tolerance: 1%; Packaging: Tape and Reel; Package Quantity: 10; Resistor Type: Thick Film; Number of Terminations: 2; Temperature Coefficient: 100ppm/°C; Max Power Dissipation: 100mW; Voltage Rating (DC): 75V; Features: Automotive AEC-Q200; Series: CRCW; Construction: Rectangular; Resistance Tolerance: 1%; Length: 1.55mm; Width: 0.033inch; Height: 0.02inch; Depth: 0.85mm; REACH SVHC: Unknown; Military Standard: Not; Lead Free: Lead Free; RoHS Compliant: Yes; ComponentLink1URL: https://datasheet.ciiva.com/2525/dcrcwe3-2525254.pdf?src-supplier=Digi-Key; ComponentLink1Description: https://datasheet.ciiva.com/2525/dcrcwe3-2525254.pdf?src-supplier=Digi-Key; ComponentLink2URL: https://datasheet.ciiva.com/2525/dcrcwe3-2525255.pdf?src-supplier=Digi-Key; ComponentLink2Description: https://datasheet.ciiva.com/2525/dcrcwe3-2525255.pdf?src-supplier=Digi-Key; ComponentLink3URL: https://datasheet.ciiva.com/2525/dcrcwe3-2525256.pdf?src-supplier=Digi-Key; ComponentLink3Description: https://datasheet.ciiva.com/2525/dcrcwe3-2525256.pdf?src-supplier=Digi-Key; ComponentLink4URL: https://datasheet.ciiva.com/9065/dcrcwe3-9065258.pdf?src-supplier=Avnet; ComponentLink4Description: https://datasheet.ciiva.com/9065/dcrcwe3-9065258.pdf?src-supplier=Avnet; ComponentLink5URL: https://datasheet.ciiva.com/5546/dcrcwe3-109170-5546746.pdf?src-supplier=Mouser; ComponentLink5Description: https://datasheet.ciiva.com/5546/dcrcwe3-109170-5546746.pdf?src-supplier=Mouser; ComponentLink6URL: https://datasheet.ciiva.com/7748/1697337-7748680.pdf?src-supplier=Element14; ComponentLink6Description: https://datasheet.ciiva.com/7748/1697337-7748680.pdf?src-supplier=Element14; ComponentLink7URL: https://datasheet.ciiva.com/22675/1700796-22675469.pdf?src-supplier=Element14; ComponentLink7Description: https://datasheet.ciiva.com/22675/1700796-22675469.pdf?src-supplier=Element14; ComponentLink8URL: https://datasheet.ciiva.com/22700/1697337-22700634.pdf?src-supplier=Element14; ComponentLink8Description: https://datasheet.ciiva.com/22700/1697337-22700634.pdf?src-supplier=Element14; ComponentLink9URL: https://datasheet.ciiva.com/22675/1700796-22675468.pdf?src-supplier=Element14; ComponentLink9Description: https://datasheet.ciiva.com/22675/1700796-22675468.pdf?src-supplier=Element14; ComponentLink10URL: https://datasheet.ciiva.com/7748/1697337-7748679.pdf?src-supplier=Element14; ComponentLink10Description: https://datasheet.ciiva.com/7748/1697337-7748679.pdf?src-supplier=Element14; Supplier Part Number 1: 541-5.62MHCT-ND
R20 = RMCF0603FT4M99: Res Thick Film 0603 4.99M Ohm 1% 1/10W ±200ppm/°C Molded SMD SMD Paper T/R; Manufacturer: Stackpole Electronics; Resistance: 4.99MR; Max Power Dissipation: 100mW; Supplier 1: Digi-Key; Manufacturer Part Number: RMCF0603FT4M99; RoHS: Yes; Category: Chip SMD Resistors; Stock 1: 2371; Pricing 1: 1=0.10000, 10=0.02500, 100=0.01020, 1000=0.00457, 2500=0.00397 (USD); Mount: Surface Mount; Case/Package: 0603; Case Code (Metric): 1608; Case Code (Imperial): 0603; Contact Plating: Tin,Matte; Min Operating Temperature: -55°C; Max Operating Temperature: 155°C; Packaging: Tape and Reel; Tolerance: 1%; Package Quantity: 5000; Resistor Type: Thick Film; Number of Terminations: 2; Temperature Coefficient: 200ppm/°C; Features: Automotive AEC-Q200; Series: RMCF; Length: 0.061inch; Width: 0.031inch; Height: 0.022inch; Radiation Hardening: No; ComponentLink1URL: https://www.seielect.com/catalog/SEI-RMCF_RMCP.pdf?src-supplier=Avnet; ComponentLink1Description: https://www.seielect.com/catalog/SEI-RMCF_RMCP.pdf?src-supplier=Avnet; ComponentLink2URL: http://www.seielect.com/Catalog/SEI-RMCF_RMCP.pdf?src-supplier=Digi-Key; ComponentLink2Description: http://www.seielect.com/Catalog/SEI-RMCF_RMCP.pdf?src-supplier=Digi-Key; ComponentLink3URL: https://www.seielect.com/Catalog/SEI-RMCF_RMCP.pdf?src-supplier=Digi-Key; ComponentLink3Description: https://www.seielect.com/Catalog/SEI-RMCF_RMCP.pdf?src-supplier=Digi-Key; ComponentLink4URL: https://www.seielect.com/catalog/SEI-Packaging.pdf?src-supplier=Digi-Key; ComponentLink4Description: https://www.seielect.com/catalog/SEI-Packaging.pdf?src-supplier=Digi-Key; Supplier Part Number 1: RMCF0603FT4M99CT-ND
R22 = RMCF0603JT4M70: Res Thick Film 0603 4.7M Ohm 5% 1/10W ±200ppm/°C Molded SMD SMD Paper T/R; Manufacturer: Stackpole Electronics; Resistance: 4.7MR; Max Power Dissipation: 100mW; Supplier 1: Digi-Key; Manufacturer Part Number: RMCF0603JT4M70; RoHS: Yes; Category: Chip SMD Resistors; Stock 1: 140486; Pricing 1: 1=0.10000, 10=0.01500, 100=0.00610, 1000=0.00274, 2500=0.00238 (USD); Mount: Surface Mount; Case/Package: 0603; Case Code (Metric): 1608; Case Code (Imperial): 0603; Contact Plating: Tin,Matte; Min Operating Temperature: -55°C; Max Operating Temperature: 155°C; Tolerance: 5%; Packaging: Tape and Reel; Resistor Type: Thick Film; Number of Terminations: 2; Temperature Coefficient: 200ppm/°C; Features: Automotive AEC-Q200; Series: RMCF; Length: 0.061inch; Width: 0.031inch; Height: 0.022inch; Radiation Hardening: No; RoHS Compliant: Yes; ComponentLink1URL: http://components.arrow.com/part/dataview/44988022S7609060N1174?src-supplier=Arrow+Electronics; ComponentLink1Description: http://components.arrow.com/part/dataview/44988022S7609060N1174?src-supplier=Arrow+Electronics; ComponentLink2URL: https://www.seielect.com/Catalog/SEI-RMCF_RMCP.pdf?src-supplier=Digi-Key; ComponentLink2Description: https://www.seielect.com/Catalog/SEI-RMCF_RMCP.pdf?src-supplier=Digi-Key; ComponentLink3URL: https://www.seielect.com/catalog/SEI-Packaging.pdf?src-supplier=Digi-Key; ComponentLink3Description: https://www.seielect.com/catalog/SEI-Packaging.pdf?src-supplier=Digi-Key; ComponentLink4URL: https://www.seielect.com/catalog/SEI-RMCF_RMCP.pdf?src-supplier=Avnet; ComponentLink4Description: https://www.seielect.com/catalog/SEI-RMCF_RMCP.pdf?src-supplier=Avnet; Supplier Part Number 1: RMCF0603JT4M70CT-ND
R23 = RT0603BRD07402RL: Res Thin Film 0603 402 Ohm 0.1% 1/10W ±25ppm/°C Molded SMD SMD Paper T/R; Manufacturer: Yageo; Resistance: 402R; Power Rating: 100mW; Voltage Rating: 75V; Voltage Rating (DC): 50V; Supplier 1: Digi-Key; Manufacturer Part Number: RT0603BRD07402RL; RoHS: Yes; Category: Chip SMD Resistors; Stock 1: 9518; Pricing 1: 1=0.34000, 10=0.28800, 100=0.11260, 1000=0.04716, 2500=0.04322 (USD); Case/Package: 0603; Case Code (Metric): 1608; Case Code (Imperial): 0603; Weight: 7.1E-05oz; Contact Plating: Tin,Matte; Min Operating Temperature: -55°C; Max Operating Temperature: 125°C; Package Quantity: 5000; Packaging: Tape and Reel; Tolerance: 0.1%; Resistor Type: Thin Film; Number of Terminations: 2; Termination: SMD/SMT; Max Power Dissipation: 100mW; Temperature Coefficient: 25ppm/°C; Series: RT; Length: 0.063inch; Width: 0.031inch; Height: 0.022inch; Radiation Hardening: No; Lead Free: Lead Free; RoHS Compliant: Yes; ComponentLink1URL: https://datasheet.ciiva.com/12809/pyu-rt-1-to-0-05-rohs-l-4-12809503.pdf?src-supplier=Mouser; ComponentLink1Description: https://datasheet.ciiva.com/12809/pyu-rt-1-to-0-05-rohs-l-4-12809503.pdf?src-supplier=Mouser; ComponentLink2URL: https://datasheet.ciiva.com/2585/pyu-rt-1-to-0-05-rohs-l-5-2585937.pdf?src-supplier=Digi-Key; ComponentLink2Description: https://datasheet.ciiva.com/2585/pyu-rt-1-to-0-05-rohs-l-5-2585937.pdf?src-supplier=Digi-Key; Supplier Part Number 1: YAG4552CT-ND
TP13 TP14 TP18 TP19 TP23-TP27 = Test_Pad
U5 = BQ25570RGRR: Switching Battery Charger Li-Ion/Li-Pol/Supercapacitor 110mA 2.2V to 5.5V 20-Pin VQFN EP T/R; Manufacturer: Texas Instruments; Operating Supply Voltage: 4V; Output Current: 100mA; Operating Supply Current: 488nA; Switching Frequency: 1MHz; Supplier 1: Digi-Key; Manufacturer Part Number: BQ25570RGRR; RoHS: Yes; Category: Battery Management; Stock 1: 2317; Pricing 1: 1=7.46000, 10=6.73900, 25=6.42560, 100=5.57930, 250=5.32852, 500=4.85836, 1000=4.73120 (USD); Mount: Surface Mount; Case/Package: VQFN; Number of Pins: 20; Contact Plating: Gold; Min Operating Temperature: -40°C; Max Operating Temperature: 125°C; Packaging: Tape and Reel; Package Quantity: 3000; RoHS Compliant: Yes; Lead Free: Lead Free; ComponentLink1URL: https://datasheet.ciiva.com/29590/bq25570-29590060.pdf?src-supplier=Digi-Key; ComponentLink1Description: https://datasheet.ciiva.com/29590/bq25570-29590060.pdf?src-supplier=Digi-Key; Supplier Part Number 1: 296-39934-1-ND
U6 = TPS2114APWR: 2.8-V to 5.5-V, 120-mΩ, 0.75-A, power mux with manual, automatic switchover and status outp; Manufacturer: Texas Instruments; Output Current: 750mA; Number of Inputs: 2; Number of Outputs: 1; Max Input Voltage: 5.5V; Min Input Voltage: 2.8V; Turn-On Delay Time: 500us; On-State Resistance: 120mR; Max Power Dissipation: 387mW; Output Voltage: 6V; Supplier 1: Mouser; Manufacturer Part Number: TPS2114APWR; Category: Voltage Regulators - Switching; Stock 1: 1837; Pricing 1: 1=2.72000, 10=2.45000, 50=2.31000, 100=1.97000, 1000=1.34000, 10000=1.34000 (USD); Case/Package: TSSOP; Number of Pins: 8; Weight: 0.001376oz; Min Operating Temperature: -40°C; Max Operating Temperature: 85°C; Packaging: Tape and Reel; Package Quantity: 2000; Max Output Current: 750mA; Current - Output 2: 750mA; Operating Supply Voltage: 5.5V; Series: -; Radiation Hardening: No; REACH SVHC: No SVHC; Lead Free: Lead Free; RoHS Compliant: Yes; ComponentLink1URL: https://datasheet.ciiva.com/15109/getdatasheetpartid-482725-15109279.pdf?src-supplier=Verical; ComponentLink1Description: https://datasheet.ciiva.com/15109/getdatasheetpartid-482725-15109279.pdf?src-supplier=Verical; ComponentLink2URL: https://datasheet.ciiva.com/1960/tps2114a-1960827.pdf?src-supplier=Digi-Key; ComponentLink2Description: https://datasheet.ciiva.com/1960/tps2114a-1960827.pdf?src-supplier=Digi-Key; ComponentLink3URL: https://datasheet.ciiva.com/1960/tps2114a-1960826.pdf?src-supplier=Digi-Key; ComponentLink3Description: https://datasheet.ciiva.com/1960/tps2114a-1960826.pdf?src-supplier=Digi-Key; ComponentLink4URL: https://datasheet.ciiva.com/1960/tps2114a-1960828.pdf?src-supplier=Digi-Key; ComponentLink4Description: https://datasheet.ciiva.com/1960/tps2114a-1960828.pdf?src-supplier=Digi-Key; ComponentLink5URL: https://octopart.com/opatz8j6/c1?t=zQLrDEklY_WILesI9dFX70XCPQqalESAK5OUho5KkzUgWAsCo4xqDffXrB-RvQpDgI2dJMolSj8W0zJSY0Bar0j4sncMa55_WC1IGBdcUb64EwC3HpU6ECUpYq3nSvmjp83guQV2BdFoXZXvrrNCVPJHxblSRqadpwtudHGRRJ4BFrVO9Hlcomcjk6Co77Ut4rO20odTsbp8Qg_eQD7kSis5ry1OWs6gjRCpaRIeg4vaw6jVFQYOorkuNHohw7l-kVe3Cr8ThlgKkmUAcUIBvmuPu802JBTwsfOWuhS4k7MsU30J3CQLXiIUvO3tA3iMdzXGzBLSydJjQJLRE9IX356ej_U0pwi4k_IbThjvlV_HcWJeheNTGM6uNq6t3yOF8VX-Ww&src-supplier=Texas+Instruments; ComponentLink5Description: https://octopart.com/opatz8j6/c1?t=zQLrDEklY_WILesI9dFX70XCPQqalESAK5OUho5KkzUgWAsCo4xqDffXrB-RvQpDgI2dJMolSj8W0zJSY0Bar0j4sncMa55_WC1IGBdcUb64EwC3HpU6ECUpYq3nSvmjp83guQV2BdFoXZXvrrNCVPJHxblSRqadpwtudHGRRJ4BFrVO9Hlcomcjk6Co77Ut4rO20odTsbp8Qg_eQD7kSis5ry1OWs6gjRCpaRIeg4vaw6jVFQYOorkuNHohw7l-kVe3Cr8ThlgKkmUAcUIBvmuPu802JBTwsfOWuhS4k7MsU30J3CQLXiIUvO3tA3iMdzXGzBLSydJjQJLRE9IX356ej_U0pwi4k_IbThjvlV_HcWJeheNTGM6uNq6t3yOF8VX-Ww&src-supplier=Texas+Instruments; ComponentLink6URL: https://datasheet.octopart.com/TPS2114APWR-Texas-Instruments-datasheet-125089.pdf?src-supplier=Texas+Instruments; ComponentLink6Description: https://datasheet.octopart.com/TPS2114APWR-Texas-Instruments-datasheet-125089.pdf?src-supplier=Texas+Instruments; ComponentLink7URL: https://datasheet.octopart.com/TPS2114APWR-Texas-Instruments-datasheet-10254381.pdf?src-supplier=Texas+Instruments; ComponentLink7Description: https://datasheet.octopart.com/TPS2114APWR-Texas-Instruments-datasheet-10254381.pdf?src-supplier=Texas+Instruments; ComponentLink8URL: https://datasheet.octopart.com/TPS2114APWR-Texas-Instruments-datasheet-10942069.pdf?src-supplier=Texas+Instruments; ComponentLink8Description: https://datasheet.octopart.com/TPS2114APWR-Texas-Instruments-datasheet-10942069.pdf?src-supplier=Texas+Instruments; ComponentLink9URL: https://datasheet.octopart.com/TPS2114APWR-Texas-Instruments-datasheet-41218291.pdf?src-supplier=Texas+Instruments; ComponentLink9Description: https://datasheet.octopart.com/TPS2114APWR-Texas-Instruments-datasheet-41218291.pdf?src-supplier=Texas+Instruments; ComponentLink10URL: https://sigma.octopart.com/49250270/technical_drawing/Texas-Instruments-TPS2114APWR.pdf?src-supplier=Texas+Instruments; ComponentLink10Description: https://sigma.octopart.com/49250270/technical_drawing/Texas-Instruments-TPS2114APWR.pdf?src-supplier=Texas+Instruments; ComponentLink11URL: https://datasheet.octopart.com/TPS2114APWR-Texas-Instruments-datasheet-151503.pdf?src-supplier=Mouser; ComponentLink11Description: https://datasheet.octopart.com/TPS2114APWR-Texas-Instruments-datasheet-151503.pdf?src-supplier=Mouser; ComponentLink12URL: https://datasheet.octopart.com/TPS2114APWR-Texas-Instruments-datasheet-159117942.pdf?src-supplier=LCSC; ComponentLink12Description: https://datasheet.octopart.com/TPS2114APWR-Texas-Instruments-datasheet-159117942.pdf?src-supplier=LCSC; ComponentLink13URL: https://datasheet.octopart.com/TPS2114APWR-Texas-Instruments-datasheet-164420067.pdf?src-supplier=SHENGYU+ELECTRONICS; ComponentLink13Description: https://datasheet.octopart.com/TPS2114APWR-Texas-Instruments-datasheet-164420067.pdf?src-supplier=SHENGYU+ELECTRONICS; ComponentLink14URL: https://datasheet.octopart.com/TPS2114APWR-Texas-Instruments-datasheet-10276.pdf?src-supplier=Digi-Key; ComponentLink14Description: https://datasheet.octopart.com/TPS2114APWR-Texas-Instruments-datasheet-10276.pdf?src-supplier=Digi-Key; ComponentLink15URL: https://datasheet.octopart.com/TPS2114APWR-Texas-Instruments-datasheet-14157958.pdf?src-supplier=iiiC; ComponentLink15Description: https://datasheet.octopart.com/TPS2114APWR-Texas-Instruments-datasheet-14157958.pdf?src-supplier=iiiC; ComponentLink16URL: https://datasheet.octopart.com/TPS2114APWR-Texas-Instruments-datasheet-17022919.pdf?src-supplier=Newark; ComponentLink16Description: https://datasheet.octopart.com/TPS2114APWR-Texas-Instruments-datasheet-17022919.pdf?src-supplier=Newark; ComponentLink17URL: https://datasheet.octopart.com/TPS2114APWR-Texas-Instruments-datasheet-33012597.pdf?src-supplier=Newark; ComponentLink17Description: https://datasheet.octopart.com/TPS2114APWR-Texas-Instruments-datasheet-33012597.pdf?src-supplier=Newark; ComponentLink18URL: https://datasheet.octopart.com/TPS2114APWR-Texas-Instruments-datasheet-33040122.pdf?src-supplier=Newark; ComponentLink18Description: https://datasheet.octopart.com/TPS2114APWR-Texas-Instruments-datasheet-33040122.pdf?src-supplier=Newark; ComponentLink19URL: https://datasheet.octopart.com/TPS2114APWR-Texas-Instruments-datasheet-82512274.pdf?src-supplier=Newark; ComponentLink19Description: https://datasheet.octopart.com/TPS2114APWR-Texas-Instruments-datasheet-82512274.pdf?src-supplier=Newark; Supplier Part Number 1: 595-TPS2114APWR